# Altium schematic sheet Driver.SchDoc
size A; SheetNumber: 1; SheetTotal: 1
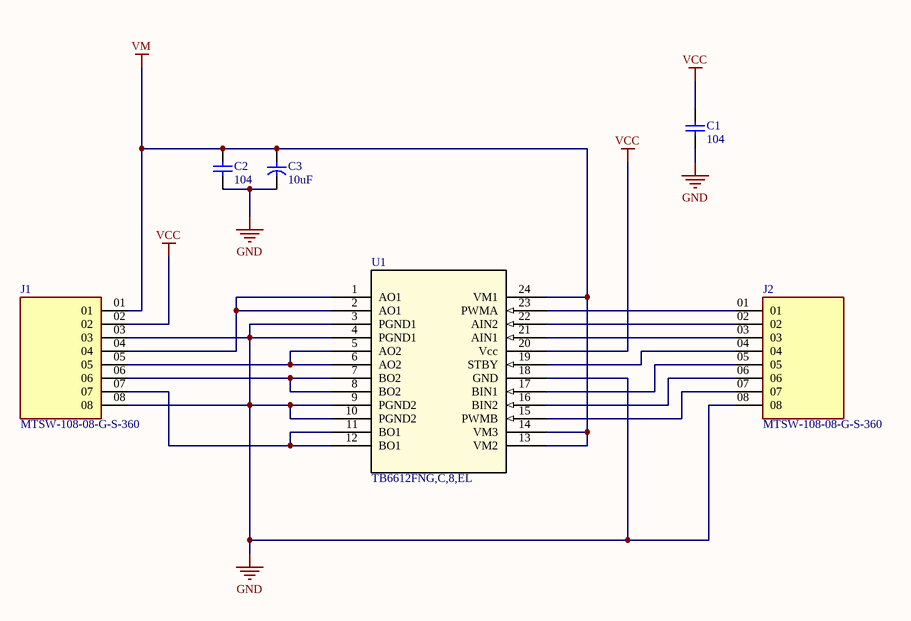
[diagram p0: Driver.SchDoc]

## Parts
C1  104  [CAP Ceramic/W200]
C2  104  [CAP Ceramic/W200]
C3  10uF  [CAP/D80/H125/LS30]
J1  MTSW-108-08-G-S-360  [SAMTEC_MTSW-108-08-G-S-360]
J2  MTSW-108-08-G-S-360  [SAMTEC_MTSW-108-08-G-S-360]
U1  TB6612FNG,C,8,EL  [SSOP24-P-300-0p65A_TOS]

## Nets
GND: C1.2 C2.2 C3.2 J1.03 J1.08 J2.08 U1.3(PGND1) U1.4(PGND1) U1.9(PGND2) U1.10(PGND2) U1.18(GND)
VCC: C1.1 J1.02 U1.20(Vcc)
VM: C2.1 C3.1 J1.01 U1.13(VM2) U1.14(VM3) U1.24(VM1)
NetJ1_04: J1.04 U1.1(AO1) U1.2(AO1)
NetJ1_05: J1.05 U1.5(AO2) U1.6(AO2)
NetJ1_06: J1.06 U1.7(BO2) U1.8(BO2)
NetJ1_07: J1.07 U1.11(BO1) U1.12(BO1)
NetJ2_01: J2.01 U1.23(PWMA)
NetJ2_02: J2.02 U1.22(AIN2)
NetJ2_03: J2.03 U1.21(AIN1)
NetJ2_04: J2.04 U1.19(STBY)
NetJ2_05: J2.05 U1.17(BIN1)
NetJ2_06: J2.06 U1.16(BIN2)
NetJ2_07: J2.07 U1.15(PWMB)

## Library data of the parts
C1 C2 = Capacitor NP: Capacitor non-pol
C3 = Capacitor: Capacitor pol
U1 = TB6612FNG,C,8,EL: Description; Manufacturer_Name: Toshiba Electronic Devices & Storage Corp.; Copyright: Copyright (C) 2025 Ultra Librarian. All rights reserved.; Manufacturer_Part_Number: TB6612FNG,C,8,EL; RefDes: RefDes; Type: Type
J1 J2 = MTSW-108-08-G-S-360: Price: None; MP: MTSW-108-08-G-S-360; Package: None; Availability: Unavailable; Value: *